# EAGLE design TSL2561_v10 (EAGLE 6.2)
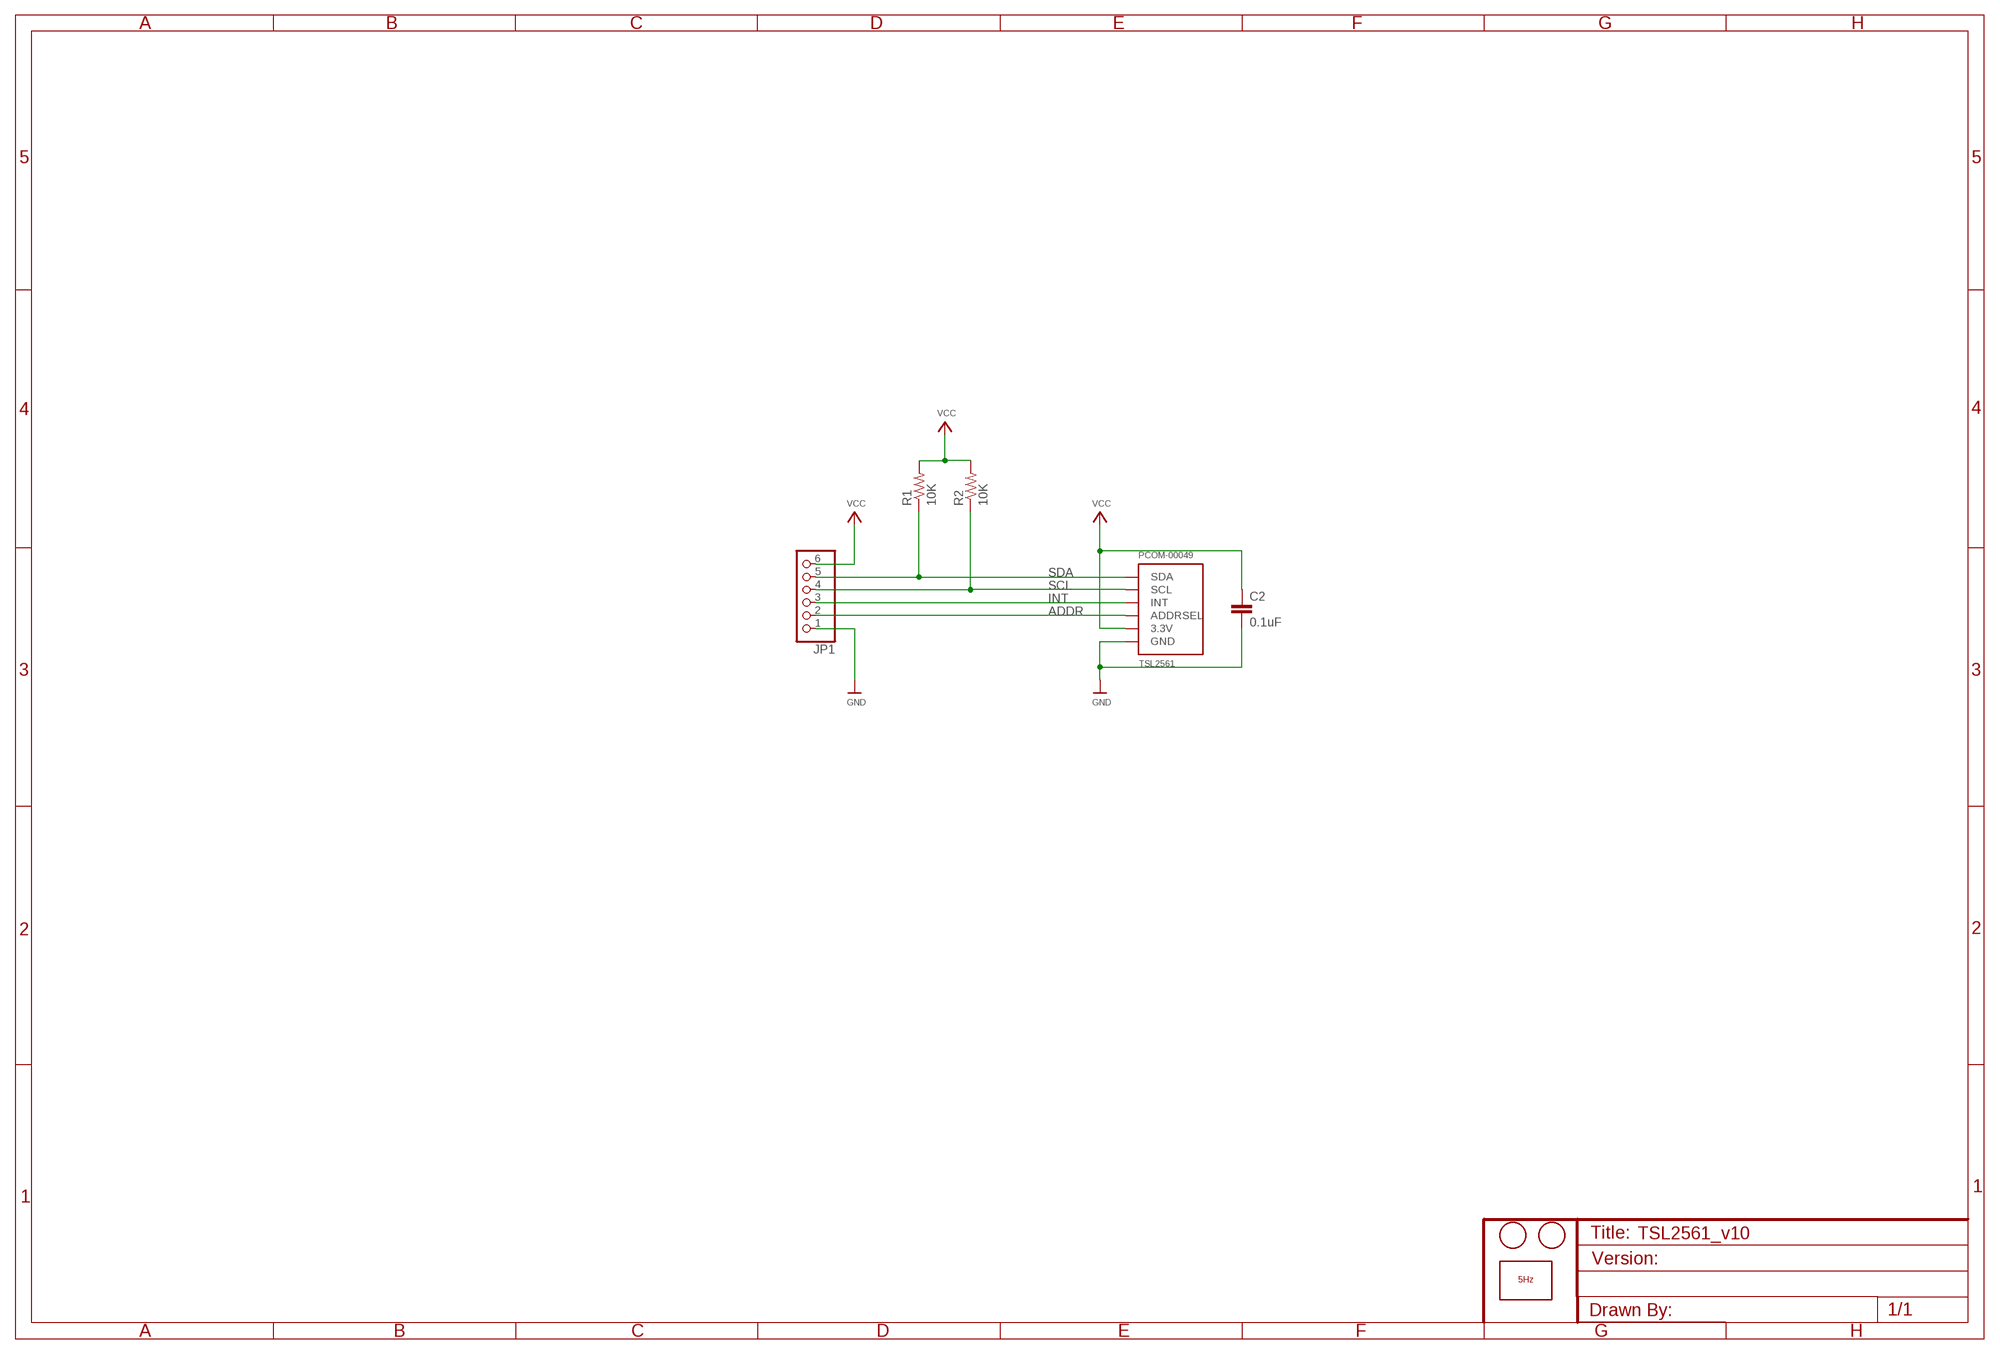
[diagram p0: schematic, sheet 1]

## Parts
C2  0.1uF  CAP0603-CAP  [0603-CAP]
JP1  HEADER-1X676MIL  [1X06_ROUND_76]
LOGO1  LOGO_5HZ_MAIN_10MM  [5HZ_LOGO_MAIN_10MM]
PCOM-00049  TSL2561  [TSL2561_FN]
R1  10K  RESISTOR0603-RES  [0603-RES]
R2  10K  RESISTOR0603-RES  [0603-RES]
U$5  MOUNTINGHOLE2.0  [MOUNTINGHOLE_2.0_PLATED]
U$6  MOUNTINGHOLE2.0  [MOUNTINGHOLE_2.0_PLATED]

## Nets
ADDR: JP1.2 PCOM-00049.ADR(ADDRSEL)
GND: C2.2 JP1.1 PCOM-00049.VSS(GND)
INT: JP1.3 PCOM-00049.INT
SCL: JP1.4 PCOM-00049.CLK(SCL) R2.1
SDA: JP1.5 PCOM-00049.DATA(SDA) R1.1
VCC: C2.1 JP1.6 PCOM-00049.VDD(3.3V) R1.2 R2.2

## Library data of the parts
C2 = SparkFun:CAP: Capacitor Standard 0603 ceramic capacitor, and 0.1" leaded capacitor.
JP1 = microbuilder:HEADER-1X6: PIN HEADER
LOGO1 = 5hz-electronica:LOGO_5HZ: Logotipo 5Hz "según Pedro"
PCOM-00049 = microbuilder:TSL2561: TSL2561 Light-To-Digital Sensor Mouser Part Numbers: CS (obsolete): 856-TSL2561CS DFN (cheapest): 856-TSL2561FN
R1 R2 = SparkFun:RESISTOR: Resistor Basic schematic elements and footprints for 0603, 1206, and PTH resistors.
U$5 U$6 = microbuilder:MOUNTINGHOLE: Mounting Hole

## Board
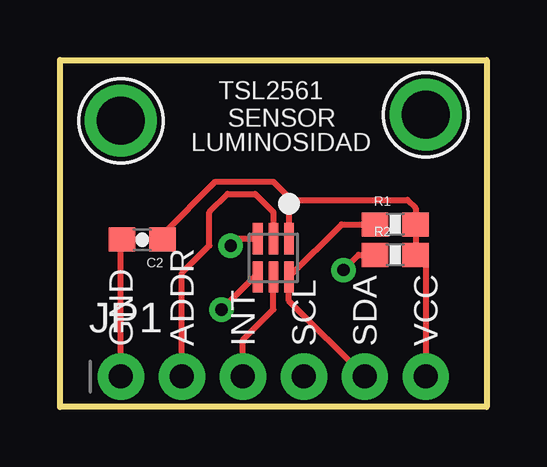
[diagram p1: board, top side]
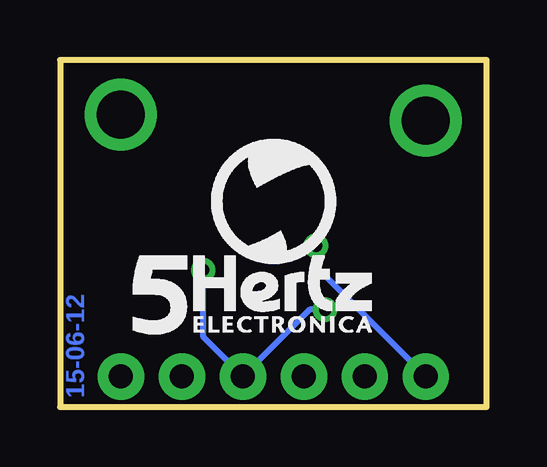
[diagram p2: board, bottom side, seen from below]

Size 17.78 x 14.48 mm. Coordinates in mm from the lower left corner, seen from the top.
Outline: 0,0 0,14.48 17.78,14.48 17.78,0 0,0
Copper layers (1*16): Top 0.035mm / dielectric 1.5mm / Bottom 0.035mm
Design rules: minimum track width 8mil, minimum drill 20mil, track to track 8mil, track to pad 8mil, pad to pad 8mil, via to via 8mil, smd to smd 8mil, copper to edge 10mil, drill to drill 8mil, minimum pad ring 12mil, minimum via ring 10mil, stop-mask expansion 4mil, vias tented up to drill 25mil, thermal gap 10mil

### Footprints (pad centres in the part's own frame; a part is rotated, then mirrored left to right if it is on the bottom)
0603-CAP = smd 1.1 x 1: 1 -0.85,0; 2 0.85,0
1X06_ROUND_76 = drill 1 pad 1.93: 1 -6.35,0; 2 -3.81,0; 3 -1.27,0; 4 1.27,0; 5 3.81,0; 6 6.35,0
TSL2561_FN = smd 1.3 x 0.4: ADR -0.8,0; CLK 0.8,-0.65; DATA 0.8,0.65; INT 0.8,0; VDD -0.8,0.65; VSS -0.8,-0.65
0603-RES = smd 1.1 x 1: 1 -0.85,0; 2 0.85,0
MOUNTINGHOLE_2.0_PLATED = drill 2 pad 3: P$1 0,0

### Placement (x,y rotation side)
C2  3.43,6.99 180 top
JP1  8.89,1.27 0 top
LOGO1  14.73,3.05 0 bottom
PCOM-00049  8.89,6.22 270 top
R1  13.97,7.62 0 top
R2  13.97,6.35 0 top
U$5  15.24,12.19 0 top
U$6  2.54,11.94 0 top

### Tracks (layer width: path | path; a pad name or v marks a point on that pad's centre or on a via)
ADDR
  Top 0.254: JP1.2 5.08,5.59 6.22,6.73 6.22,8.13 6.99,8.89 8.13,8.89 8.89,8.13 PCOM-00049.ADR
GND  (via drill 0.51)
  Top 0.254: JP1.1 2.54,6.95 C2.2 | PCOM-00049.VSS 7.4,7.02 v7.11,6.73
  Bottom 0.254: v7.11,6.73 7.11,5.84 JP1.1
INT
  Top 0.254: JP1.3 7.62,2.79 8.89,4.06 PCOM-00049.INT
SCL  (via drill 0.51)
  Top 0.254: PCOM-00049.CLK 8.09,5.42 v6.73,4.06 | R2.1 12.45,6.35 v11.81,5.71
  Bottom 0.254: v6.73,4.06 7.37,4.06 JP1.4 11.81,2.92 v11.81,5.71
SDA
  Top 0.254: JP1.5 9.54,4.43 PCOM-00049.DATA 11.74,7.62 R1.1
VCC
  Top 0.254: C2.1 4.28,7.2 6.48,9.4 8.89,9.4 9.53,8.76 9.53,8.64 | 9.53,8.64 9.53,7.04 PCOM-00049.VDD | JP1.6 15.24,5.93 R2.2 R1.2 14.82,8.29 14.48,8.64 9.53,8.64

### Text on the board
Bottom: 15-06-12
tPlace: TSL2561 | SENSOR | LUMINOSIDAD | GND | ADDR | INT | SCL | SDA | VCC